# Altium schematic sheet Power_Key.SchDoc: SIM868 Development Board
size 149 x 149 mm; SheetNumber: 7; SheetTotal: 14
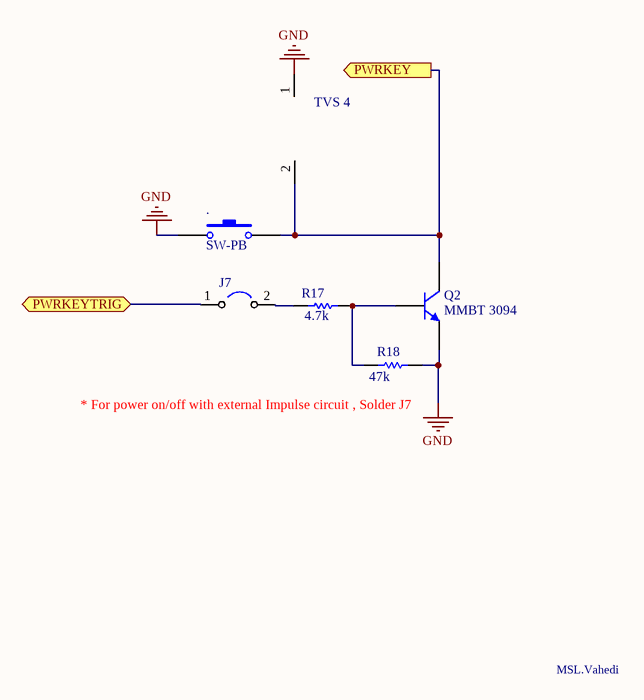
[diagram p0: Power_Key.SchDoc]

## Parts
.  SW-PB  [BUTTON_MICRO_SWITCH]
J7  (no value)  [JuMPER]
Q2  MMBT 3094  [SOT-23]
R17  value 4.7k  [RES0805]
R18  value 47k  [RES0805]
TVS_4  (no value)  [*FB_BLM18PG121SN1D]

## Ports
PWRKEY (out), PWRKEYTRIG (bidir)

## Nets
GND: ..1 Q2.1(E) R18.2 TVS_4.1
PWRKEY: ..2 Q2.3(C) TVS_4.2 ; port PWRKEY
PWRKEYTRIG: J7.1 ; port PWRKEYTRIG
NetJ7_2: J7.2 R17.1
NetQ2_2: Q2.2(B) R17.2 R18.1

## Notes on the sheet
- (near R18) * For power on/off with external Impulse circuit , Solder J7
- MSL.Vahedi

## Library data of the parts
. = SW-PB: Switch; Published: 24-Mar-1999; LatestRevisionDate: 17-Jul-2002; LatestRevisionNote: Re-released for DXP Platform.; PackageReference: SPST-2; Publisher: Altium Limited; PackageDescription: Switch; 2 Leads
J7 = JUMPER
Q2 = 2N3904: NPN General Purpose Amplifier; Published: 8-Jun-2000; LatestRevisionDate: 15-Jan-2003; LatestRevisionNote: PCB Footprint 'BCY-W3/D4.7' replaced; DatasheetVersion: 1997; PackageVersion: Sep-1998; PackageReference: TO-92A; Publisher: Altium Limited; PackageDescription: TO, Flat Index; 3 In-Line, Axial Leads; Body Dia. 4.5mm; Leads 0.51 x 0.48 mm (max); ComponentLink1Description: Manufacturer Link; ComponentLink1URL: http://www.fairchildsemi.com/; ComponentLink2Description: Datasheet; ComponentLink2URL: http://www.fairchildsemi.com/ds/2N%2F2N3904.pdf
R17 R18 = Res1: Resistor; Published: 8-Jun-2000; LatestRevisionDate: 17-Jul-2002; LatestRevisionNote: Re-released for DXP Platform.; PackageReference: AXIAL-0.3; Publisher: Altium Limited; PackageDescription: Axial Device, Thru-Hole; 2 Leads; 0.3 in Pin Spacing
TVS_4 = TVS